# Altium project MotorDrive.PrjPcb
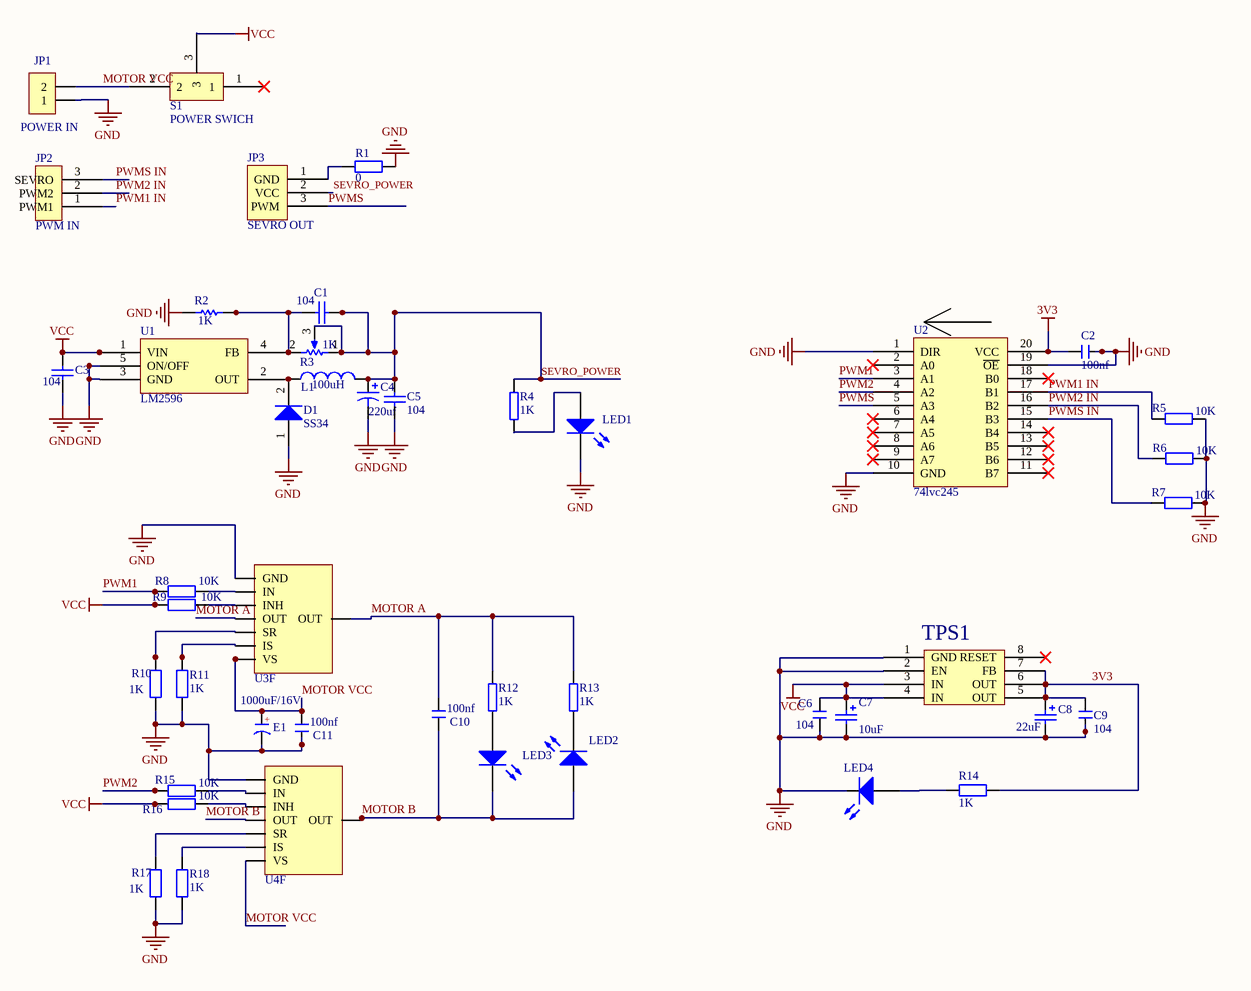
[diagram p0: MotorDrive.SchDoc]
1 sheet, 45 parts. Net scope: global (net labels, ports and power ports of the same name join across sheets).
Board file: MotorDrive.PcbDoc

## Sheet MotorDrive.SchDoc
size A3; SheetNumber: 1; SheetTotal: 1

### Parts
C1  value 104  [C0805]  (hidden comment: 电容)
C2  100nf  [C 0805_M]
C3  value 104  [C0805]  (hidden comment: 电容)
C4  value 220uf  [CAPPR1.27-1.7x2.8]  (hidden comment: Cap Pol1)
C5  value 104  [C0805]
C6  104  [C 0805_M]
C7  10uf  [CD A(3216)]
C8  22uf  [CD A(3216)]
C9  104  [C 0805_M]
C10  100nf  [C 0805_M]
C11  100nf  [C 0805_M]
D1  SS34  [SMC]
E1  1000uF/16V  [CM F(10*10.2)]
JP1  POWER IN  [KF301-5.0-2P]
JP2  PWM IN  [XH2.54-LI-3P]
JP3  SEVRO OUT  [HDR2.54-LI-3P]
L1  value 100uH  [INDC4532L]  (hidden comment: Inductor)
LED1  LED0  [SOD-323]  (value not drawn)
LED2  LED0  [SOD-323]  (value not drawn)
LED3  LED0  [SOD-323]  (value not drawn)
LED4  LED0  [SOD-323]  (value not drawn)
R1  0  [14-1210]
R2  value 1K  [C0805]  (hidden comment: Res1)
R3  value 1K  [3269W_滑动变阻器]  (hidden comment: RPot)
R4  value 1K  [C0805]  (hidden comment: RES)
R5  10K  [R 0805_M]
R6  10K  [R 0805_M]
R7  10K  [R 0805_M]
R8  10K  [R 0805_M]
R9  10K  [R 0805_M]
R10  1K  [R 0805_M]
R11  1K  [R 0805_M]
R12  value 1K  [C0805]  (hidden comment: RES)
R13  value 1K  [C0805]  (hidden comment: RES)
R14  1K  [R 0805_M]
R15  10K  [R 0805_M]
R16  10K  [R 0805_M]
R17  1K  [R 0805_M]
R18  1K  [R 0805_M]
S1  POWER SWICH  [MTS-10x]
TPS1  TPS7333  [SO8NB]  (value not drawn)
U1  LM2596  [lm2587]
U2  74lvc245  [74lvc245 TSSOP]
U3  BTN7971B  [TO-263-7_L10.2-W10.4-P1.27-LS14.4-B]  (value not drawn)  (part F of 6)
U4  BTN7971B  [TO-263-7_L10.2-W10.4-P1.27-LS14.4-B]  (value not drawn)  (part F of 6)

### Nets
3V3: C2.2 C8.1 C9.2 R14.2 TPS1.5(OUT) TPS1.6(OUT) TPS1.7(FB) U2.20(VCC)
GND: C2.1 C3.1 C4.2 C5.1 C6.1 C7.2 C8.2 C9.1 C11.1 D1.1(A) E1.2(K) JP1.1 LED1.2(K) LED4.2(K) R1.2 R2.1 R5.1 R6.1 R7.1 R10.1 R11.1 R17.1 R18.1 TPS1.1(GND) TPS1.2(EN) U1.3(GND) U1.5(ON/OFF) U2.1(DIR) U2.10(GND) U2.19(~{OE}) U3.1(GND) U4.1(GND)
VCC: C3.2 C6.2 C7.1 R9.2 R16.2 S1.3 TPS1.3(IN) TPS1.4(IN) U1.1(VIN)
MOTOR A: C10.2 R12.2 R13.2 U3.4(OUT) U3.8(OUT)
MOTOR B: C10.1 LED2.1(A) LED3.2(K) U4.4(OUT) U4.8(OUT)
MOTOR VCC: C11.2 E1.1(A) JP1.2 S1.2 U3.7(VS) U4.7(VS)
PWM1: R8.2 U2.3(A1)
PWM1 IN: JP2.1(PWM1) R5.2 U2.17(B1)
PWM2: R15.2 U2.4(A2)
PWM2 IN: JP2.2(PWM2) R6.2 U2.16(B2)
PWMS: JP3.3(PWM) U2.5(A3)
PWMS IN: JP2.3(SEVRO) R7.2 U2.15(B3)
SEVRO_POWER: C1.2 C4.1 C5.2 JP3.2(VCC) L1.2 R3.1(TOP) R3.3(TAP) R4.2
NetC1_1: C1.1 R2.2 R3.2(BOT) U1.4(FB)
NetD1_2: D1.2(K) L1.1 U1.2(OUT)
NetJP3_1: JP3.1(GND) R1.1(vcc)
NetLED1_1: LED1.1(A) R4.1
NetLED2_2: LED2.2(K) R13.1
NetLED3_1: LED3.1(A) R12.1
NetLED4_1: LED4.1(A) R14.1
NetR8_1: R8.1 U3.2(IN)
NetR9_1: R9.1 U3.3(INH)
NetR10_2: R10.2 U3.5(SR)
NetR11_2: R11.2 U3.6(IS)
NetR15_1: R15.1 U4.2(IN)
NetR16_1: R16.1 U4.3(INH)
NetR17_2: R17.2 U4.5(SR)
NetR18_2: R18.2 U4.6(IS)

Not connected (* = marked no-connect by the designer): S1 1*; TPS1 8(RESET)*; U2 2(A0)* 6(A4)* 7(A5)* 8(A6)* 9(A7)* 11(B7)* 12(B6)* 13(B5)* 14(B4)* 18(B0)*

### Notes on the sheet
- (in symbol C-CM) +

### Library data of the parts
C1 C3 C5 = 电容: Capacitor; Published: 8-Jun-2000; LatestRevisionDate: 17-Jul-2002; LatestRevisionNote: Re-released for DXP Platform.; PackageReference: RAD-0.3; Publisher: Altium Limited; PackageDescription: Radial Cap, Thru-Hole; 2 Leads; 0.3 in Pin Spacing
C2 C6 C9-C11 = C: 无极性贴片电容; 版权归属: 源创客; BOM名称: 无极性贴片电容; 学习资源: www.ooocke.com
C4 C7 C8 = Cap Pol1: Polarized Capacitor (Radial); Published: 8-Jun-2000; LatestRevisionDate: 17-Jul-2002; LatestRevisionNote: Re-released for DXP Platform.; PackageReference: RB7.6-15; Publisher: Altium Limited
  C7: PackageDescription: Polarized Capacitor (Radial); 2 Leads; Value: 10uF
  C8: PackageDescription: Polarized Capacitor (Radial); 2 Leads; Value: 22uF
D1 = Diode 1N4148: High Conductance Fast Diode; Published: 8-Jun-2000; LatestRevisionDate: 17-Jul-2002; LatestRevisionNote: Re-released for DXP Platform.; DatasheetVersion: 1997; PackageReference: DO-35; Publisher: Altium Limited; Code_JEDEC: DO-204-AH; ComponentLink1Description: Manufacturer Link; ComponentLink1URL: http://www.fairchildsemi.com/; ComponentLink2Description: Datasheet; ComponentLink2URL: http://www.fairchildsemi.com/ds/1N%2F1N4148.pdf
E1 = C-CM: 贴片电解电容; 版权归属: 源创客; BOM名称: 贴片电解电容; 学习资源: www.ooocke.com
JP1 = Header 2: 2P接插件; 版权归属: 源创客; BOM名称: 2P接插件; 学习资源: www.ooocke.com
JP2 = Component_1
L1 = Inductor: Code_IEC: 1005; Published: 8-Jun-2000; LatestRevisionDate: 29-May-2009; LatestRevisionNote: IPC-7351 Footprint Added.; PackageReference: 0402-A; Publisher: Altium Limited; PackageDescription: Chip Inductor; Code_JEITA: 0402
LED1-LED4 = LED0: Typical INFRARED GaAs LED; Published: 8-Jun-2000; LatestRevisionDate: 08-Jul-2005; LatestRevisionNote: Mech Layer 1 removed.; PackageReference: LED-0; Publisher: Altium Limited
R1 = RES_MD_2
R2 = Res1: Resistor; Published: 8-Jun-2000; LatestRevisionDate: 17-Jul-2002; LatestRevisionNote: Re-released for DXP Platform.; PackageReference: AXIAL-0.3; Publisher: Altium Limited
R3 = RPot: Potentiometer; Sim Note: Enter the Resistance value and the set point into parameter fields.; Set Position: 0.5; Published: 8-Jun-2000; LatestRevisionDate: 17-Jul-2002; LatestRevisionNote: Re-released for DXP Platform.; PackageReference: VR5; Publisher: Altium Limited
R4 R12 R13 = 电阻
R5-R11 R14-R18 = R: 贴片电阻; 版权归属: 源创客; BOM名称: 贴片电阻; 学习资源: www.ooocke.com
S1 = SWICH
TPS1 = TPS7350
U2 = 74lvc245: 8位5伏转3.3伏电平转换芯片